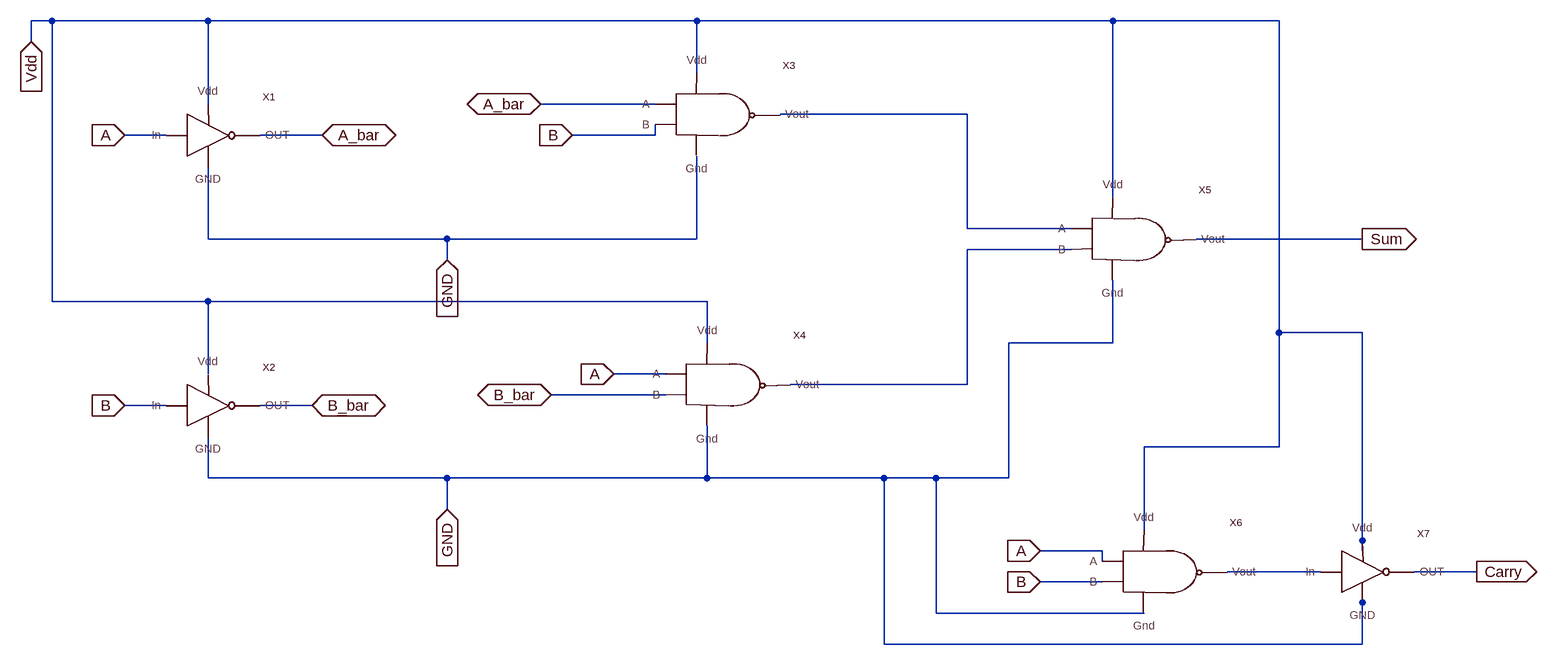
[diagram p0: schematic HALF_ADDER.asc]
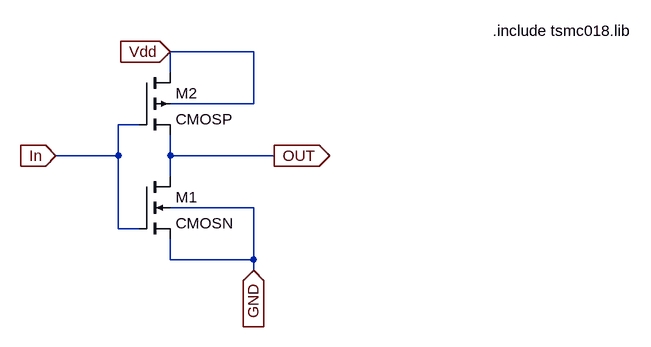
[diagram p1: sub-circuit inverter_gate.asc]
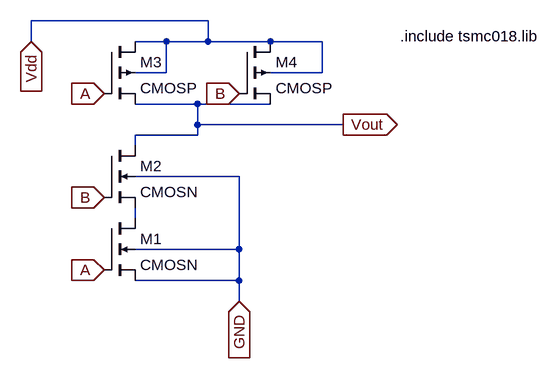
[diagram p2: sub-circuit nand_gate.asc]
HALF_ADDER.asc, the LTspice schematic file:
Version 4
SHEET 1 2144 916
WIRE -176 -48 -208 -48
WIRE 64 -48 -176 -48
WIRE 816 -48 64 -48
WIRE 1456 -48 816 -48
WIRE 1712 -48 1456 -48
WIRE -208 -16 -208 -48
WIRE 816 32 816 -48
WIRE 64 80 64 -48
WIRE 752 80 576 80
WIRE 1232 96 944 96
WIRE 0 128 -64 128
WIRE 240 128 144 128
WIRE 752 128 752 112
WIRE 752 128 624 128
WIRE 1456 224 1456 -48
WIRE 1232 272 1232 96
WIRE 1392 272 1232 272
WIRE 64 288 64 176
WIRE 432 288 64 288
WIRE 816 288 816 160
WIRE 816 288 432 288
WIRE 1840 288 1584 288
WIRE 1392 304 1232 304
WIRE 432 320 432 288
WIRE -176 384 -176 -48
WIRE 64 384 -176 384
WIRE 832 384 64 384
WIRE 1712 432 1712 -48
WIRE 1840 432 1712 432
WIRE 832 448 832 384
WIRE 1456 448 1456 352
WIRE 1456 448 1296 448
WIRE 64 496 64 384
WIRE 768 496 688 496
WIRE 1232 512 1232 304
WIRE 1232 512 960 512
WIRE 768 528 592 528
WIRE 0 544 -64 544
WIRE 224 544 144 544
WIRE 1712 608 1712 432
WIRE 1712 608 1504 608
WIRE 64 656 64 592
WIRE 432 656 64 656
WIRE 832 656 832 576
WIRE 832 656 432 656
WIRE 1104 656 832 656
WIRE 1184 656 1104 656
WIRE 1296 656 1296 448
WIRE 1296 656 1184 656
WIRE 432 704 432 656
WIRE 1504 736 1504 608
WIRE 1840 752 1840 432
WIRE 1440 768 1344 768
WIRE 1840 768 1840 752
WIRE 1440 784 1440 768
WIRE 1776 800 1632 800
WIRE 2016 800 1920 800
WIRE 1440 816 1344 816
WIRE 1840 848 1840 832
WIRE 1184 864 1184 656
WIRE 1504 864 1184 864
WIRE 1104 912 1104 656
WIRE 1840 912 1840 848
WIRE 1840 912 1104 912
FLAG -64 128 A
IOPIN -64 128 In
FLAG -64 544 B
IOPIN -64 544 In
FLAG 224 544 B_bar
IOPIN 224 544 BiDir
FLAG 240 128 A_bar
IOPIN 240 128 BiDir
FLAG -208 -16 Vdd
IOPIN -208 -16 In
FLAG 576 80 A_bar
IOPIN 576 80 BiDir
FLAG 624 128 B
IOPIN 624 128 In
FLAG 688 496 A
IOPIN 688 496 In
FLAG 592 528 B_bar
IOPIN 592 528 BiDir
FLAG 432 320 GND
IOPIN 432 320 In
FLAG 432 704 GND
IOPIN 432 704 In
FLAG 1344 768 A
IOPIN 1344 768 In
FLAG 1344 816 B
IOPIN 1344 816 In
FLAG 2016 800 Carry
IOPIN 2016 800 Out
FLAG 1840 288 Sum
IOPIN 1840 288 Out
SYMBOL INVERTER_Gate 208 128 R0
SYMATTR InstName X1
SYMBOL INVERTER_Gate 208 544 R0
SYMATTR InstName X2
SYMBOL NAND_Gate 928 96 R0
SYMATTR InstName X3
SYMBOL NAND_Gate 944 512 R0
SYMATTR InstName X4
SYMBOL NAND_Gate 1568 288 R0
SYMATTR InstName X5
SYMBOL NAND_Gate 1616 800 R0
SYMATTR InstName X6
SYMBOL INVERTER_Gate 1984 800 R0
SYMATTR InstName X7

inverter_gate.asc, the sub-circuit schematic file:
Version 4
SHEET 1 1204 680
WIRE 576 -240 448 -240
WIRE 448 -208 448 -240
WIRE 576 -160 576 -240
WIRE 576 -160 448 -160
WIRE 400 -128 368 -128
WIRE 368 -80 368 -128
WIRE 368 -80 272 -80
WIRE 448 -80 448 -112
WIRE 608 -80 448 -80
WIRE 448 -48 448 -80
WIRE 576 0 448 0
WIRE 368 32 368 -80
WIRE 400 32 368 32
WIRE 448 80 448 48
WIRE 576 80 576 0
WIRE 576 80 448 80
WIRE 576 96 576 80
FLAG 448 -240 Vdd
IOPIN 448 -240 In
FLAG 272 -80 In
IOPIN 272 -80 In
FLAG 608 -80 OUT
IOPIN 608 -80 Out
FLAG 576 96 GND
IOPIN 576 96 In
SYMBOL cmosn 400 -48 R0
SYMATTR InstName M1
SYMBOL cmosp 400 -208 R0
SYMATTR InstName M2
TEXT 944 -272 Left 2 !.include tsmc018.lib

nand_gate.asc, the sub-circuit schematic file:
Version 4
SHEET 1 880 680
WIRE 272 -48 0 -48
WIRE 0 -16 0 -48
WIRE 208 -16 160 -16
WIRE 272 -16 272 -48
WIRE 272 -16 208 -16
WIRE 368 -16 272 -16
WIRE 448 -16 368 -16
WIRE 208 32 208 -16
WIRE 208 32 160 32
WIRE 448 32 448 -16
WIRE 448 32 368 32
WIRE 256 80 160 80
WIRE 368 80 256 80
WIRE 256 112 256 80
WIRE 480 112 256 112
WIRE 256 128 256 112
WIRE 256 128 160 128
WIRE 160 144 160 128
WIRE 320 192 160 192
WIRE 160 256 160 240
WIRE 320 304 320 192
WIRE 320 304 160 304
WIRE 320 352 320 304
WIRE 320 352 160 352
WIRE 320 384 320 352
FLAG 112 336 A
IOPIN 112 336 In
FLAG 112 224 B
IOPIN 112 224 In
FLAG 320 64 B
IOPIN 320 64 In
FLAG 112 64 A
IOPIN 112 64 In
FLAG 0 -16 Vdd
IOPIN 0 -16 In
FLAG 480 112 Vout
IOPIN 480 112 Out
FLAG 320 384 GND
IOPIN 320 384 In
SYMBOL cmosn 112 256 R0
SYMATTR InstName M1
SYMBOL cmosn 112 144 R0
SYMATTR InstName M2
SYMBOL cmosp 112 -16 R0
SYMATTR InstName M3
SYMBOL cmosp 320 -16 R0
SYMATTR InstName M4
TEXT 568 -24 Left 2 !.include tsmc018.lib

The netlist it stands for:
* HALF_ADDER.asc
XX1 A A_bar Vdd GND inverter_gate
XX2 B B_bar Vdd GND inverter_gate
XX3 A_bar B Vdd GND N001 nand_gate
XX4 A B_bar Vdd GND N002 nand_gate
XX5 N001 N002 Vdd GND Sum nand_gate
XX6 A B Vdd GND N003 nand_gate
XX7 N003 Carry Vdd GND inverter_gate

* block symbol definitions
.subckt inverter_gate In OUT Vdd GND
M1 OUT In GND GND CMOSN
M2 Vdd In OUT Vdd CMOSP
.include tsmc018.lib
.ends inverter_gate

.subckt nand_gate A B Vdd Gnd Vout
M1 N001 A GND GND CMOSN
M2 Vout B N001 GND CMOSN
M3 Vdd A Vout Vdd CMOSP
M4 Vdd B Vout Vdd CMOSP
.include tsmc018.lib
.ends nand_gate

.model NMOS NMOS
.model PMOS PMOS
.lib standard.mos
.backanno
.end